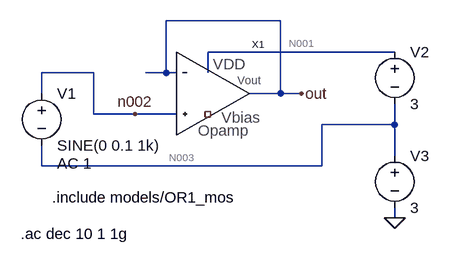
[diagram p0: schematic volfol_tb.asc]
volfol_tb.asc, the LTspice schematic file:
Version 4
SHEET 1 880 680
WIRE 256 32 80 32
WIRE 432 80 144 80
WIRE -32 112 -112 112
WIRE 80 112 80 32
WIRE 80 112 48 112
WIRE 96 112 80 112
WIRE 144 112 144 80
WIRE -112 144 -112 112
WIRE 256 144 256 32
WIRE 256 144 208 144
WIRE 288 144 256 144
WIRE -32 176 -32 112
WIRE 32 176 -32 176
WIRE 96 176 32 176
WIRE 432 192 432 160
WIRE 432 192 320 192
WIRE 432 240 432 192
WIRE -112 256 -112 224
WIRE 320 256 320 192
WIRE 320 256 -112 256
WIRE 432 336 432 320
FLAG 432 336 0
FLAG 288 144 out
FLAG 32 176 n002
SYMBOL Opamp3ureiauto 176 144 R0
SYMATTR InstName X1
SYMBOL voltage -112 128 R0
WINDOW 123 24 124 Left 2
WINDOW 39 0 0 Left 2
SYMATTR Value2 AC 1
SYMATTR InstName V1
SYMATTR Value SINE(0 0.1 1k)
SYMBOL voltage 432 64 R0
SYMATTR InstName V2
SYMATTR Value 3
SYMBOL voltage 432 224 R0
SYMATTR InstName V3
SYMATTR Value 3
TEXT -96 304 Left 2 !.include models/OR1_mos
TEXT -144 360 Left 2 !.ac dec 10 1 1g

The netlist it stands for:
* volfol_tb.asc
XX1 out n002 out N001 NC_01 Opamp3ureiauto  ; pins Vinm Vinp Vout VDD Vbias
V1 n002 N003 SINE(0 0.1 1k) AC 1
V2 N001 N003 3
V3 N003 0 3
.include models/OR1_mos
.ac dec 10 1 1g
.backanno
.end

* Results of the author's LTspice run, read from the files saved beside the schematic
* Operating Point, zero values left out:
*   V(out) = 3 V
*   V(n001) = 6 V
*   V(n002) = 3 V
*   V(n003) = 3 V
*   I(V3) = -539.5 µA
*   I(V2) = -539.5 µA
*   Ix(x1:VDD) = 539.5 µA
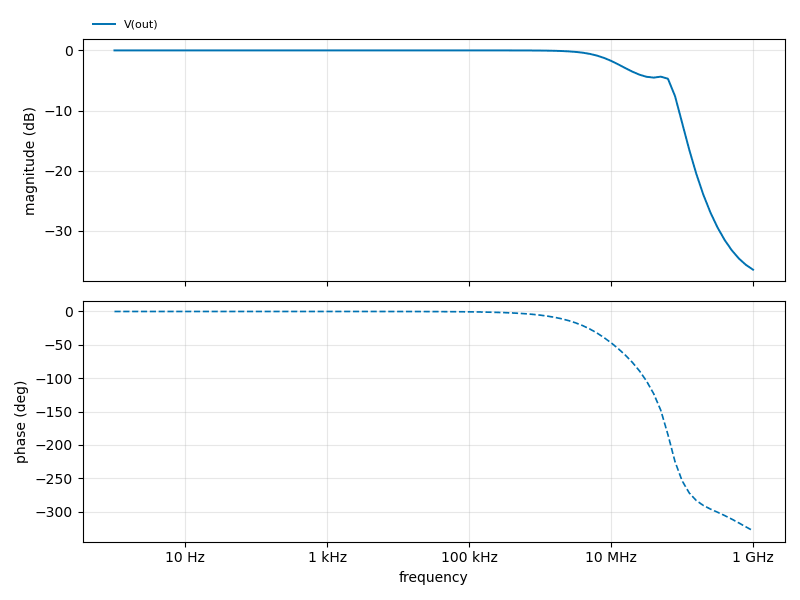
[diagram p1: AC Analysis of volfol_tb.asc, plotted from the saved traces]
* AC Analysis, 1 run:
*   V(out): 0.00 dB at 1 Hz, -36.45 dB at 1 GHz, peak 0.00 dB at 1 Hz, 3 dB below the peak at 16.26 MHz